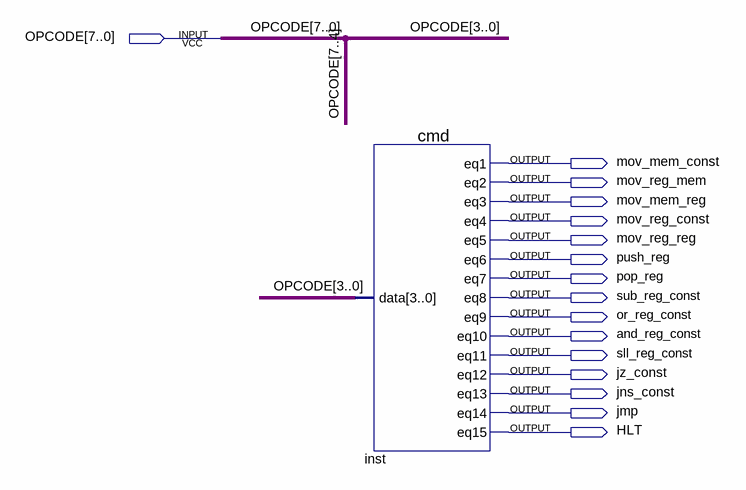
[diagram p0: schematic sheet]
// Quartus schematic command.bdf as structural Verilog: 1 symbols, 16 pins
module command (
  input  [7:0] OPCODE,
  output mov_mem_const,
  output mov_reg_mem,
  output mov_mem_reg,
  output mov_reg_const,
  output mov_reg_reg,
  output push_reg,
  output pop_reg,
  output sub_reg_const,
  output or_reg_const,
  output and_reg_const,
  output sll_reg_const,
  output jz_const,
  output jns_const,
  output jmp,
  output HLT
);

  cmd inst (
    .data(OPCODE[3:0]), .eq1(mov_mem_const), .eq2(mov_reg_mem), .eq3(mov_mem_reg), .eq4(mov_reg_const),
    .eq5(mov_reg_reg), .eq6(push_reg), .eq7(pop_reg), .eq8(sub_reg_const), .eq9(or_reg_const),
    .eq10(and_reg_const), .eq11(sll_reg_const), .eq12(jz_const), .eq13(jns_const), .eq14(jmp), .eq15(HLT));
endmodule
